# Altium schematic sheet POWER.SchDoc
size A4
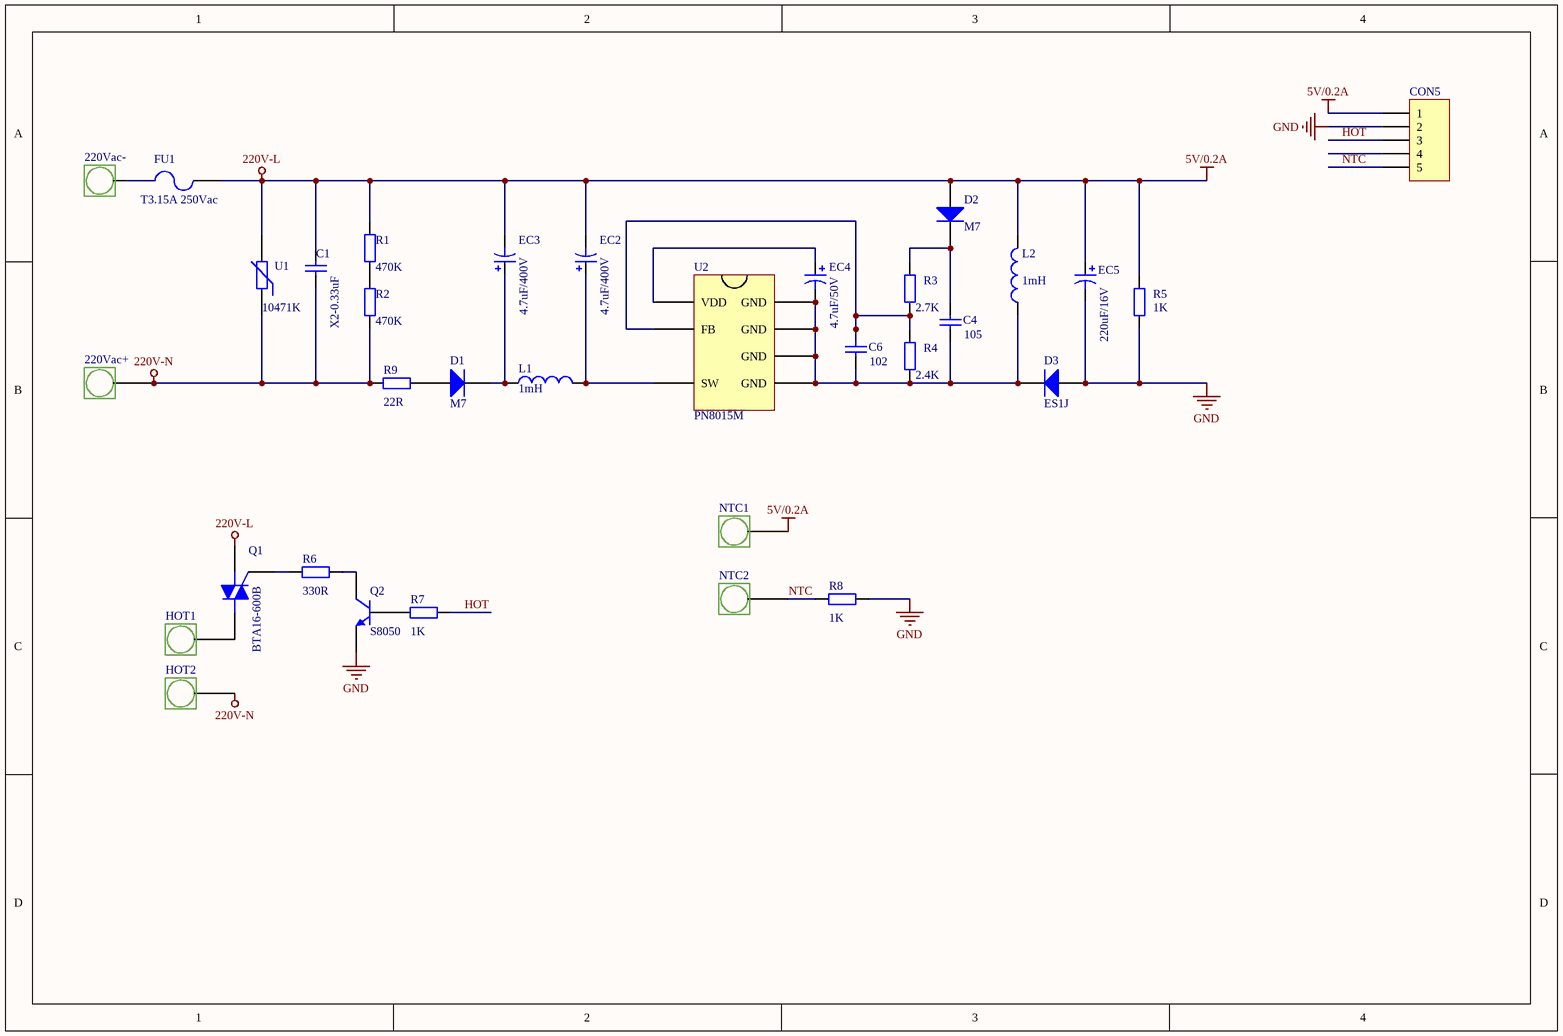
[diagram p0: POWER.SchDoc]

## Parts
220Vac+  焊接点  [HanJie]  (value not drawn)
220Vac-  焊接点  [HanJie]  (value not drawn)
C1  X2-0.33uF  [X2-AnGuiDianRong]
C4  value 105  [6-0805_N]  (hidden comment: 电容)
C6  value 102  [6-0805_N]  (hidden comment: 电容)
CON5  连接器  [HEADER_5]  (value not drawn)
D1  M7  [ErJiGuan-M7]
D2  M7  [ErJiGuan-M7]
D3  ES1J  [ErJiGuan-M7]
EC2  value 4.7uF/400V  [DianRong-3.5mm]  (hidden comment: 电容)
EC3  value 4.7uF/400V  [DianRong-3.5mm]  (hidden comment: 电容)
EC4  value 4.7uF/50V  [DianRong-3.3mm]  (hidden comment: 电容)
EC5  value 220uF/16V  [DianRong-3.2mm]  (hidden comment: 电容)
FU1  T3.15A 250Vac  [BaoXianSi]
HOT1  焊接点  [HanJie]  (value not drawn)
HOT2  焊接点  [HanJie]  (value not drawn)
L1  value 1mH  [DianGan-12.5mm]  (hidden comment: 电感)
L2  value 1mH  [DianGan]  (hidden comment: 电感)
NTC1  焊接点  [HanJie]  (value not drawn)
NTC2  焊接点  [HanJie]  (value not drawn)
Q1  BTA16-600B  [BTA16-600B]
Q2  S8050  [SOT-23_L]
R1  value 470K  [6-0805_N]  (hidden comment: 电阻)
R2  value 470K  [6-0805_N]  (hidden comment: 电阻)
R3  value 2.7K  [6-0805_N]  (hidden comment: 电阻)
R4  value 2.4K  [6-0805_N]  (hidden comment: 电阻)
R5  value 1K  [6-0805_N]  (hidden comment: 电阻)
R6  value 330R  [6-0805_N]  (hidden comment: 电阻)
R7  value 1K  [6-0805_N]  (hidden comment: 电阻)
R8  value 1K  [6-0805_N]  (hidden comment: 电阻)
R9  value 22R  [DianZhu-20mm]  (hidden comment: 电阻)
U1  10471K  [YaMinDianZhu]
U2  PN8015M  [SOP7-PN8015M]

## Nets
220V-L: C1.2 CON5.1 D2.1(A) EC2.2 EC3.2 EC5.1 FU1.2 L2.2 NTC1.1(P) Q1.1(M1) R1.2 R5.2 U1.2  [also labelled 5V/0.2A]
220V-N: 220Vac+.1(P) C1.1 HOT2.1(P) R2.1 R9.1 U1.1
GND: CON5.2 D3.1(A) EC5.2 Q2.2(E) R5.1 R8.2
HOT: CON5.3 R7.2
NTC: CON5.5 NTC2.1(P) R8.1
Net220Vac-_1: 220Vac-.1(P) FU1.1
NetC4_1: C4.1 C6.1 D3.2(K) EC4.2 L2.1 R4.1 U2.4(GND) U2.5(GND) U2.6(GND) U2.7(GND)
NetC4_2: C4.2 D2.2(K) R3.2
NetC6_2: C6.2 R3.1 R4.2 U2.2(FB)
NetD1_1: D1.1(A) R9.2
NetD1_2: D1.2(K) EC3.1 L1.1
NetEC2_1: EC2.1 L1.2 U2.3(SW)
NetEC4_1: EC4.1 U2.1(VDD)
NetHOT1_1: HOT1.1(P) Q1.2(M2)
NetQ1_3: Q1.3(G) R6.1
NetQ2_1: Q2.1(B) R7.1
NetQ2_3: Q2.3(C) R6.2
NetR1_1: R1.1 R2.2

Not connected (* = marked no-connect by the designer): CON5 4

## Library data of the parts
220Vac+ 220Vac- HOT1 HOT2 NTC1 NTC2 = PORT
C1 C4 C6 = Cap: Capacitor; Published: 8-Jun-2000; LatestRevisionDate: 17-Jul-2002; LatestRevisionNote: Re-released for DXP Platform.; PackageReference: RAD-0.3; Publisher: Altium Limited; PackageDescription: Radial Cap, Thru-Hole; 2 Leads; 0.3 in Pin Spacing
  C1: Value: X2-0.33uF
CON5 = Header 5: Header, 5-Pin; LatestRevisionDate: 17-Jul-2002; LatestRevisionNote: Re-released for DXP Platform.; Publisher: Altium Limited
D1 = Diode 1N4001: 1 Amp General Purpose Rectifier; Published: 8-Jun-2000; LatestRevisionDate: 17-Jul-2002; LatestRevisionNote: Re-released for DXP Platform.; DatasheetVersion: 1998; PackageVersion: Aug-1999; PackageReference: DO-41; Publisher: Altium Limited; PackageDescription: Diode, Axial; Body 5.2 x 2.7 mm (LxDia. max), Lead Dia. 0.86 mm (max); Code_JEDEC: DO-204-AL; ComponentLink1Description: Manufacturer Link; ComponentLink1URL: http://www.fairchildsemi.com/; ComponentLink2Description: Datasheet; ComponentLink2URL: http://www.fairchildsemi.com/ds/1N%2F1N4001.pdf; value: M7
D2 = Diode 1N4007: 1 Amp General Purpose Rectifier; Published: 8-Jun-2000; LatestRevisionDate: 17-Jul-2002; LatestRevisionNote: Re-released for DXP Platform.; DatasheetVersion: 1998; PackageVersion: Aug-1999; PackageReference: DO-41; Publisher: Altium Limited; PackageDescription: Diode, Axial; Body 5.2 x 2.7 mm (LxDia. max), Lead Dia. 0.86 mm (max); Code_JEDEC: DO-204-AL; ComponentLink1Description: Manufacturer Link; ComponentLink1URL: http://www.fairchildsemi.com/; ComponentLink2Description: Datasheet; ComponentLink2URL: http://www.fairchildsemi.com/ds/1N%2F1N4001.pdf; value: M7
D3 = Diode: Default Diode; Published: 8-Jun-2000; LatestRevisionDate: 17-Jul-2002; LatestRevisionNote: Re-released for DXP Platform.; PackageVersion: Sep-1996; PackageReference: SMC; Publisher: Altium Limited; PackageDescription: DO-214-AB/SMC; 2 C-Bend Leads; Body 7.9 x 5.9 mm, inc. leads (LxW); Code_JEDEC: DO-214-AB; value: ES1J
EC2-EC5 = Cap Pol1: Polarized Capacitor (Radial); Published: 8-Jun-2000; LatestRevisionDate: 17-Jul-2002; LatestRevisionNote: Re-released for DXP Platform.; PackageReference: RB7.6-15; Publisher: Altium Limited; PackageDescription: Polarized Capacitor (Radial); 2 Leads
FU1 = Fuse 2: Fuse; Published: 8-Jun-2000; LatestRevisionDate: 17-Jul-2002; LatestRevisionNote: Re-released for DXP Platform.; PackageReference: PIN-W2/E2.8; Publisher: Altium Limited; PackageDescription: Thru-Hole; 2 Leads; value: T3.15A 250Vac
L1 L2 = Inductor: Code_IEC: 1005; Published: 8-Jun-2000; LatestRevisionDate: 29-May-2009; LatestRevisionNote: IPC-7351 Footprint Added.; PackageReference: 0402-A; Publisher: Altium Limited; PackageDescription: Chip Inductor; Code_JEITA: 0402
Q1 = Triac: Silicon Bidirectional Triode Thyristor; Note: Pin 2 is electrically connected to Pin 4 (TAB); Published: 29-Sep-2000; LatestRevisionDate: 17-Jul-2002; LatestRevisionNote: Re-released for DXP Platform.; DatasheetVersion: 1999; PackageReference: 369-03; Publisher: Altium Limited; PackageDescription: TO, Thru-Hole, Vertical, Heatsink Mounted; 3 In-Line Leads; Pitch 2.28 mm; ComponentLink1Description: Manufacturer Link; ComponentLink1URL: http://www.motorola.com/
Q2 = QNPN: NPN Bipolar Transistor; Published: 8-Jun-2000; LatestRevisionDate: 29-May-2009; LatestRevisionNote: IPC-7351 Footprint Added.; PackageVersion: Aug-1999; PackageReference: SOT-23B; Publisher: Altium Limited; PackageDescription: 3-Pin SOT-23 Package 0.95 mm Pitch, 2.4 mm Lead Span; value: S8050
R1-R9 = Res2: Resistor; Published: 8-Jun-2000; LatestRevisionDate: 17-Jul-2002; LatestRevisionNote: Re-released for DXP Platform.; PackageReference: AXIAL-0.4; Publisher: Altium Limited; PackageDescription: Axial Device, Thru-Hole; 2 Leads; 0.4 in Pin Spacing
U1 = Res Varistor: Varistor (Voltage-Sensitive Resistor); Published: 24-Mar-1999; LatestRevisionDate: 29-May-2009; LatestRevisionNote: IPC-7351 Footprint Added.; PackageVersion: Mar-2003; PackageReference: 6-0805; Publisher: Altium Limited; PackageDescription: Chip Resistor 0805 Case Size; Code_IPC: RESC2012
U2 = PN8015